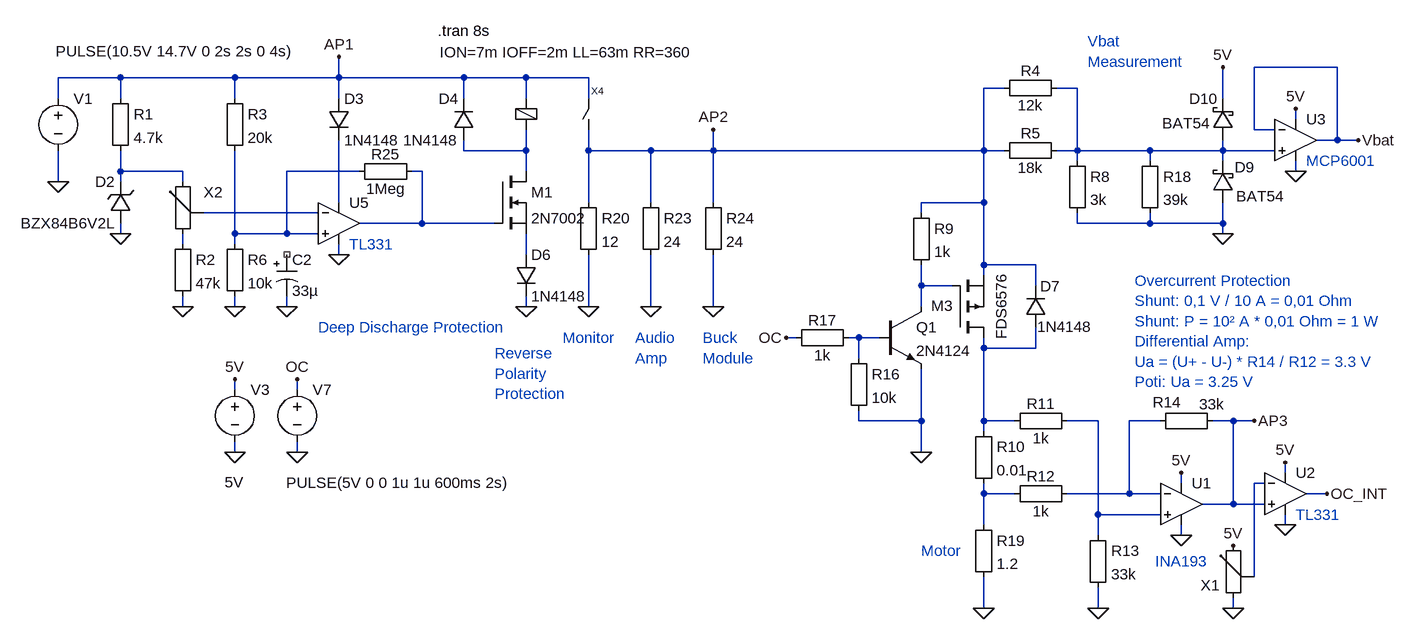
[diagram p0: schematic supply.asc]
supply.asc, the LTspice schematic file:
Version 4
SHEET 1 2516 1148
WIRE 1824 -16 1696 -16
WIRE -48 0 -144 0
WIRE 128 0 -48 0
WIRE 288 0 288 -32
WIRE 288 0 128 0
WIRE 480 0 288 0
WIRE 576 0 480 0
WIRE 672 0 576 0
WIRE 1312 16 1280 16
WIRE 1424 16 1392 16
WIRE -144 32 -144 0
WIRE -48 32 -48 0
WIRE 128 32 128 0
WIRE 288 32 288 0
WIRE 480 32 480 0
WIRE 576 32 576 0
WIRE 672 32 672 0
WIRE 1648 32 1648 -16
WIRE 1760 64 1760 48
WIRE 1696 80 1696 -16
WIRE 1728 80 1696 80
WIRE 1824 96 1824 -16
WIRE 1824 96 1792 96
WIRE 1856 96 1824 96
WIRE 480 112 480 96
WIRE 576 112 576 80
WIRE 576 112 480 112
WIRE 672 112 672 80
WIRE 768 112 672 112
WIRE 864 112 864 80
WIRE 864 112 768 112
WIRE 1280 112 1280 16
WIRE 1280 112 864 112
WIRE 1312 112 1280 112
WIRE 1424 112 1424 16
WIRE 1424 112 1392 112
WIRE 1536 112 1424 112
WIRE 1648 112 1648 96
WIRE 1648 112 1536 112
WIRE 1728 112 1648 112
WIRE 1424 128 1424 112
WIRE 1536 128 1536 112
WIRE 1648 128 1648 112
WIRE -48 144 -48 112
WIRE 48 144 -48 144
WIRE 320 144 208 144
WIRE 416 144 400 144
WIRE 576 144 576 112
WIRE 1760 144 1760 128
WIRE -144 160 -144 112
WIRE -48 160 -48 144
WIRE 48 160 48 144
WIRE 288 192 288 96
WIRE 672 192 672 112
WIRE 768 192 768 112
WIRE 864 192 864 112
WIRE 1280 192 1280 112
WIRE 1280 192 1184 192
WIRE 256 208 80 208
WIRE 1184 208 1184 192
WIRE 416 224 416 144
WIRE 416 224 320 224
WIRE 528 224 416 224
WIRE 1424 224 1424 208
WIRE 1536 224 1536 208
WIRE 1536 224 1424 224
WIRE 1648 224 1648 192
WIRE 1648 224 1536 224
WIRE -48 240 -48 224
WIRE 128 240 128 112
WIRE 208 240 208 144
WIRE 208 240 128 240
WIRE 256 240 208 240
WIRE 1648 240 1648 224
WIRE 48 256 48 240
WIRE 128 256 128 240
WIRE 288 272 288 256
WIRE 576 272 576 240
WIRE 1280 288 1280 192
WIRE 1360 288 1280 288
WIRE 1280 304 1280 288
WIRE 1184 320 1184 288
WIRE 1232 320 1184 320
WIRE 1360 320 1360 288
WIRE 48 352 48 336
WIRE 128 352 128 336
WIRE 208 352 208 336
WIRE 576 352 576 336
WIRE 672 352 672 272
WIRE 768 352 768 272
WIRE 864 352 864 272
WIRE 1184 352 1184 320
WIRE 992 400 976 400
WIRE 1088 400 1072 400
WIRE 1120 400 1088 400
WIRE 1280 416 1280 400
WIRE 1360 416 1360 384
WIRE 1360 416 1280 416
WIRE 1088 432 1088 400
WIRE 128 480 128 464
WIRE 224 480 224 464
WIRE 1088 528 1088 512
WIRE 1184 528 1184 448
WIRE 1184 528 1088 528
WIRE 1280 528 1280 416
WIRE 1328 528 1280 528
WIRE 1456 528 1408 528
WIRE 1552 528 1504 528
WIRE 1664 528 1632 528
WIRE 1696 528 1664 528
WIRE 1280 544 1280 528
WIRE 128 576 128 560
WIRE 224 576 224 560
WIRE 1184 576 1184 528
WIRE 1744 608 1744 592
WIRE 1584 624 1584 608
WIRE 1712 624 1696 624
WIRE 1280 640 1280 624
WIRE 1328 640 1280 640
WIRE 1504 640 1504 528
WIRE 1504 640 1408 640
WIRE 1552 640 1504 640
WIRE 1808 640 1776 640
WIRE 1664 656 1664 528
WIRE 1664 656 1616 656
WIRE 1712 656 1664 656
WIRE 1456 672 1456 528
WIRE 1552 672 1456 672
WIRE 1280 688 1280 640
WIRE 1744 688 1744 672
WIRE 1456 704 1456 672
WIRE 1584 704 1584 688
WIRE 1696 768 1696 624
WIRE 1280 816 1280 768
WIRE 1456 816 1456 784
WIRE 1664 816 1664 800
FLAG 1856 96 Vbat
FLAG 1456 816 0
FLAG 1584 704 0
FLAG 1280 816 0
FLAG 224 576 0
FLAG 224 464 OC
FLAG 1584 608 5V
FLAG 1744 592 5V
FLAG 1744 688 0
FLAG 1664 816 0
FLAG 1664 720 5V
FLAG 1808 640 OC_INT
FLAG 1184 576 0
FLAG 976 400 OC
FLAG 128 576 0
FLAG 128 464 5V
FLAG 1760 144 0
FLAG 1760 48 5V
FLAG 1648 -16 5V
FLAG 1648 240 0
FLAG 288 272 0
FLAG 48 352 0
FLAG -48 240 0
FLAG -144 160 0
FLAG 128 352 0
FLAG 208 352 0
FLAG 576 352 0
FLAG 672 352 0
FLAG 768 352 0
FLAG 864 352 0
FLAG 288 -32 AP1
FLAG 864 80 AP2
FLAG 1696 528 AP3
SYMBOL Misc\\EuropeanResistor 1296 128 R270
WINDOW 0 27 56 VTop 2
WINDOW 3 5 56 VBottom 2
SYMATTR InstName R5
SYMATTR Value 18k
SYMBOL Misc\\EuropeanResistor 1408 112 R0
SYMATTR InstName R8
SYMATTR Value 3k
SYMBOL schottky 1664 192 R180
WINDOW 0 -33 54 Left 2
WINDOW 3 -78 10 Left 2
SYMATTR InstName D9
SYMATTR Value BAT54
SYMATTR Description Zener Diode
SYMATTR Type zener
SYMBOL Misc\\EuropeanResistor 1264 528 R0
SYMATTR InstName R10
SYMATTR Value 0.01
SYMBOL Misc\\EuropeanResistor 1312 544 R270
WINDOW 0 27 56 VTop 2
WINDOW 3 5 56 VBottom 2
SYMATTR InstName R11
SYMATTR Value 1k
SYMBOL Misc\\EuropeanResistor 1312 656 R270
WINDOW 0 27 56 VTop 2
WINDOW 3 5 56 VBottom 2
SYMATTR InstName R12
SYMATTR Value 1k
SYMBOL Misc\\EuropeanResistor 1440 688 R0
SYMATTR InstName R13
SYMATTR Value 33k
SYMBOL Misc\\EuropeanResistor 1536 544 R270
WINDOW 0 29 26 VTop 2
WINDOW 3 57 95 VBottom 2
SYMATTR InstName R14
SYMATTR Value 33k
SYMBOL voltage 224 464 R0
WINDOW 123 0 0 Left 2
WINDOW 39 0 0 Left 2
WINDOW 3 -17 159 Left 2
SYMATTR Value PULSE(5V 0 0 1u 1u 600ms 2s)
SYMATTR InstName V7
SYMBOL Opamps\\UniversalOpamp2 1584 656 R0
SYMATTR InstName U1
SYMBOL Opamps\\UniversalOpamp2 1744 640 R0
SYMATTR InstName U2
SYMBOL pot 1648 704 R0
WINDOW 0 -34 77 Left 2
SYMATTR InstName X1
SYMATTR SpiceLine R=10k Val=34
SYMBOL Misc\\EuropeanResistor 1088 384 R90
WINDOW 0 5 56 VBottom 2
WINDOW 3 27 56 VTop 2
SYMATTR InstName R17
SYMATTR Value 1k
SYMBOL Misc\\EuropeanResistor 1168 192 R0
SYMATTR InstName R9
SYMATTR Value 1k
SYMBOL pmos 1232 400 M180
WINDOW 0 -33 49 Left 2
WINDOW 3 75 -3 VRight 2
SYMATTR InstName M3
SYMATTR Value FDS6576
SYMBOL npn 1120 352 R0
SYMATTR InstName Q1
SYMATTR Value 2N4124
SYMBOL Misc\\EuropeanResistor 1072 416 R0
SYMATTR InstName R16
SYMATTR Value 10k
SYMBOL voltage 128 464 R0
WINDOW 123 0 0 Left 2
WINDOW 39 0 0 Left 2
WINDOW 3 -16 158 Left 2
SYMATTR Value 5V
SYMATTR InstName V3
SYMBOL Opamps\\UniversalOpamp2 1760 96 R0
SYMATTR InstName U3
SYMBOL schottky 1664 96 R180
WINDOW 0 24 64 Left 2
WINDOW 3 36 26 Left 2
SYMATTR InstName D10
SYMATTR Value BAT54
SYMATTR Description Zener Diode
SYMATTR Type zener
SYMBOL voltage -144 16 R0
WINDOW 3 -4 -57 Left 2
WINDOW 123 0 0 Left 2
WINDOW 39 0 0 Left 2
SYMATTR Value PULSE(10.5V 14.7V 0 2s 2s 0 4s)
SYMATTR InstName V1
SYMBOL zener -32 224 R180
WINDOW 0 24 64 Left 2
WINDOW 3 24 0 Left 2
SYMATTR InstName D2
SYMATTR Value BZX84B6V2L
SYMATTR Description Diode
SYMATTR Type diode
SYMBOL Misc\\EuropeanResistor -64 16 R0
SYMATTR InstName R1
SYMATTR Value 4.7k
SYMBOL Misc\\EuropeanResistor 32 240 R0
SYMATTR InstName R2
SYMATTR Value 47k
SYMBOL Misc\\EuropeanResistor 112 16 R0
SYMATTR InstName R3
SYMATTR Value 20k
SYMBOL Misc\\EuropeanResistor 112 240 R0
SYMATTR InstName R6
SYMATTR Value 10k
SYMBOL pot 32 144 R0
SYMATTR InstName X2
SYMATTR SpiceLine R=100k Val=62.5
SYMBOL relais 608 64 R0
WINDOW 39 -165 -103 Left 2
SYMATTR SpiceLine ION=7m IOFF=2m LL=63m RR=360
SYMATTR InstName X4
SYMBOL polcap 192 272 R0
SYMATTR InstName C2
SYMATTR Value 33µ
SYMATTR SpiceLine V=16V
SYMBOL Opamps\\UniversalOpamp2 288 224 R0
SYMATTR InstName U5
SYMBOL nmos 528 144 R0
SYMATTR InstName M1
SYMATTR Value 2N7002
SYMBOL diode 272 32 R0
SYMATTR InstName D3
SYMATTR Value 1N4148
SYMBOL diode 496 96 R180
WINDOW 0 24 64 Left 2
WINDOW 3 24 0 Left 2
SYMATTR InstName D4
SYMATTR Value 1N4148
SYMBOL Misc\\EuropeanResistor 1296 32 R270
WINDOW 0 27 56 VTop 2
WINDOW 3 5 56 VBottom 2
SYMATTR InstName R4
SYMATTR Value 12k
SYMBOL Misc\\EuropeanResistor 1520 112 R0
SYMATTR InstName R18
SYMATTR Value 39k
SYMBOL Misc\\EuropeanResistor 1264 672 R0
SYMATTR InstName R19
SYMATTR Value 1.2
SYMBOL Misc\\EuropeanResistor 656 176 R0
SYMATTR InstName R20
SYMATTR Value 12
SYMBOL Misc\\EuropeanResistor 752 176 R0
SYMATTR InstName R23
SYMATTR Value 24
SYMBOL Misc\\EuropeanResistor 848 176 R0
SYMATTR InstName R24
SYMATTR Value 24
SYMBOL Misc\\EuropeanResistor 416 128 R90
WINDOW 0 5 56 VBottom 2
WINDOW 3 27 56 VTop 2
SYMATTR InstName R25
SYMATTR Value 1Meg
SYMBOL diode 560 272 R0
SYMATTR InstName D6
SYMATTR Value 1N4148
SYMBOL diode 1376 384 R180
WINDOW 0 -22 63 Left 2
WINDOW 3 -71 1 Left 2
SYMATTR InstName D7
SYMATTR Value 1N4148
TEXT 440 -72 Left 2 !.tran 8s
TEXT 1512 312 Left 2 ;Overcurrent Protection\nShunt: 0,1 V / 10 A = 0,01 Ohm\nShunt: P = 10² A * 0,01 Ohm = 1 W\nDifferential Amp: \nUa = (U+ - U-) * R14 / R12 = 3.3 V\nPoti: Ua = 3.25 V
TEXT 528 424 Left 2 ;Reverse\nPolarity\nProtection
TEXT 256 384 Left 2 ;Deep Discharge Protection
TEXT 632 400 Left 2 ;Monitor
TEXT 744 400 Left 2 ;Audio\nAmp
TEXT 1184 728 Left 2 ;Motor
TEXT 1440 -56 Left 2 ;Vbat\nMeasurement
TEXT 848 400 Left 2 ;Buck\nModule
TEXT 1760 672 Left 2 ;TL331
TEXT 1544 744 Left 2 ;INA193
TEXT 1776 128 Left 2 ;MCP6001
TEXT 304 256 Left 2 ;TL331

The netlist it stands for:
* supply.asc
R5 AP2 N001 18k
R8 N001 0 3k
D9 0 N001 BAT54
R10 N012 N016 0.01
R11 N012 N013 1k
R12 N016 N014 1k
R13 N013 0 33k
R14 N014 AP3 33k
V7 OC 0 PULSE(5V 0 0 1u 1u 600ms 2s)
XU1 N013 N014 5V 0 AP3 level.2 Avol=1Meg GBW=10Meg Slew=10Meg ilimit=25m rail=0 Vos=0 phimargin=45 en=0 enk=0 in=0 ink=0 Rin=500Meg  ; pins IN+ IN- V+ V- OUT
XU2 AP3 N015 5V 0 OC_INT level.2 Avol=1Meg GBW=10Meg Slew=10Meg ilimit=25m rail=0 Vos=0 phimargin=45 en=0 enk=0 in=0 ink=0 Rin=500Meg  ; pins IN+ IN- V+ V- OUT
XX1 5V N015 0 pot R=10k Val=34  ; pins 1 2 3
R17 N011 OC 1k
R9 AP2 N010 1k
M3 N012 N010 AP2 AP2 FDS6576
Q1 N010 N011 0 0 2N4124
R16 N011 0 10k
V3 5V 0 5V
XU3 N001 Vbat 5V 0 Vbat level.2 Avol=1Meg GBW=10Meg Slew=10Meg ilimit=25m rail=0 Vos=0 phimargin=45 en=0 enk=0 in=0 ink=0 Rin=500Meg  ; pins IN+ IN- V+ V- OUT
D10 N001 5V BAT54
V1 AP1 0 PULSE(10.5V 14.7V 0 2s 2s 0 4s)
D2 0 N003 BZX84B6V2L
R1 AP1 N003 4.7k
R2 N008 0 47k
R3 AP1 N004 20k
R6 N004 0 10k
XX2 N003 N007 N008 pot R=100k Val=62.5  ; pins 1 2 3
XX4 AP1 N002 AP1 AP2 relais params: ION=7m IOFF=2m LL=63m RR=360  ; pins 1 2 3 4
C2 NC_01 0 33µ V=16V
XU5 N004 N007 N006 0 N005 level.2 Avol=1Meg GBW=10Meg Slew=10Meg ilimit=25m rail=0 Vos=0 phimargin=45 en=0 enk=0 in=0 ink=0 Rin=500Meg  ; pins IN+ IN- V+ V- OUT
M1 N002 N005 N009 N009 2N7002
D3 AP1 N006 1N4148
D4 N002 AP1 1N4148
R4 AP2 N001 12k
R18 N001 0 39k
R19 N016 0 1.2
R20 AP2 0 12
R23 AP2 0 24
R24 AP2 0 24
R25 N005 N004 1Meg
D6 N009 0 1N4148
D7 N012 AP2 1N4148
.model D D
.lib standard.dio
.model NPN NPN
.model PNP PNP
.lib standard.bjt
.model NMOS NMOS
.model PMOS PMOS
.lib standard.mos
.tran 8s
* Overcurrent Protection
* Shunt: 0,1 V / 10 A = 0,01 Ohm
* Shunt: P = 10² A * 0,01 Ohm = 1 W
* Differential Amp:
* Ua = (U+ - U-) * R14 / R12 = 3.3 V
* Poti: Ua = 3.25 V
* Reverse
* Polarity
* Protection
* Deep Discharge Protection
* Monitor
* Audio
* Amp
* Motor
* Vbat
* Measurement
* Buck
* Module
* TL331
* INA193
* MCP6001
* TL331
.lib UniversalOpamps2.sub
.backanno
.end